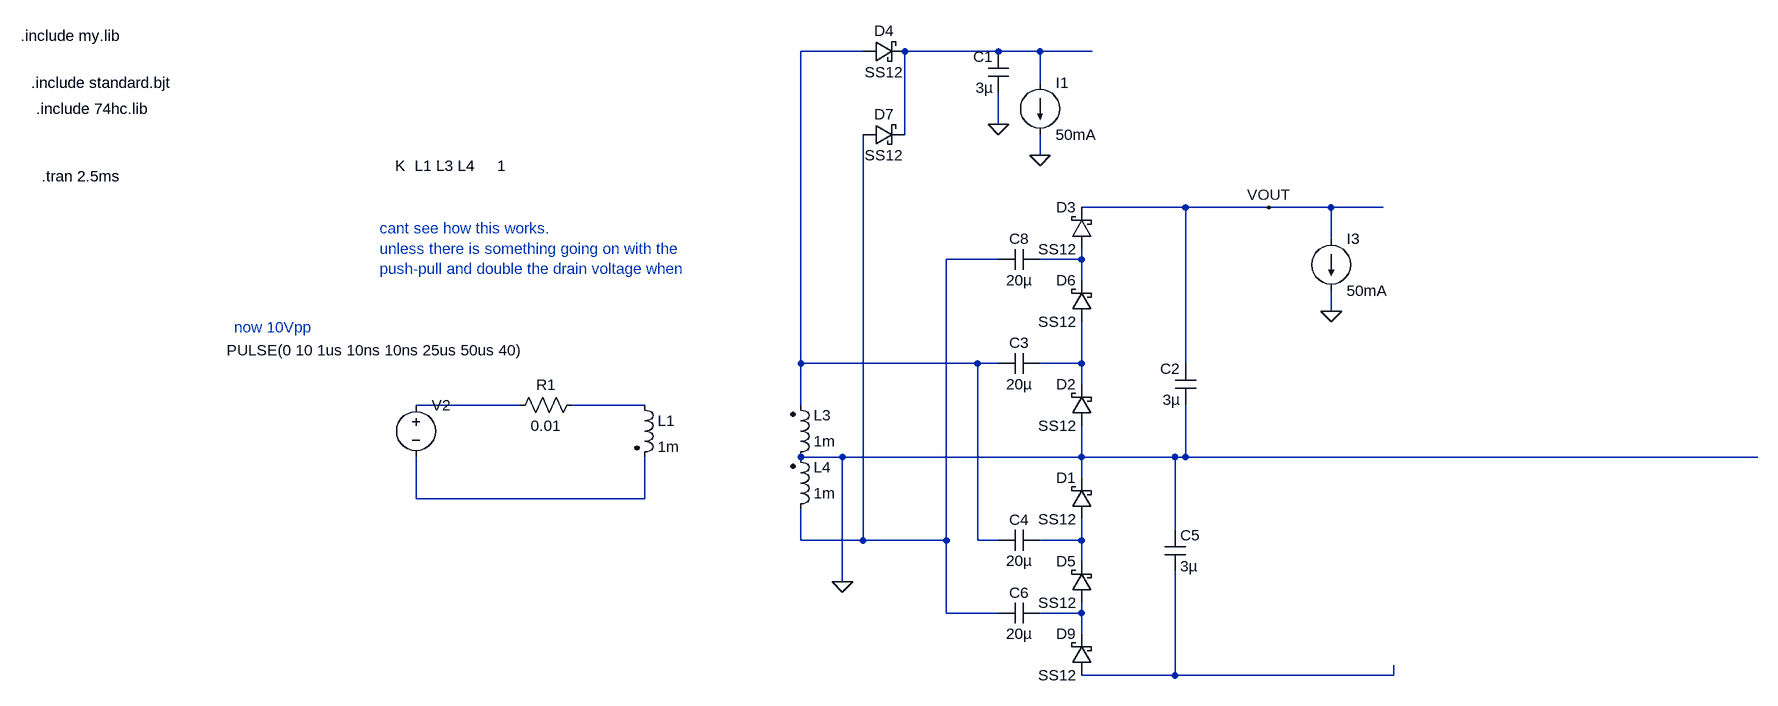
[diagram p0: schematic Draft100.asc]
Draft100.asc, the LTspice schematic file:
Version 4
SHEET 1 5720 1740
WIRE 1840 -672 1744 -672
WIRE 2048 -672 1904 -672
WIRE 2112 -672 2048 -672
WIRE 2192 -672 2112 -672
WIRE 2112 -624 2112 -672
WIRE 2048 -560 2048 -608
WIRE 1904 -544 1904 -672
WIRE 2112 -512 2112 -544
WIRE 2336 -432 2176 -432
WIRE 2464 -432 2336 -432
WIRE 2560 -432 2464 -432
WIRE 2640 -432 2560 -432
WIRE 2560 -384 2560 -432
WIRE 2048 -352 1968 -352
WIRE 2176 -352 2176 -368
WIRE 2176 -352 2112 -352
WIRE 2176 -320 2176 -352
WIRE 2560 -272 2560 -304
WIRE 1744 -192 1744 -672
WIRE 2016 -192 1744 -192
WIRE 2048 -192 2016 -192
WIRE 2176 -192 2176 -256
WIRE 2176 -192 2112 -192
WIRE 2336 -192 2336 -432
WIRE 2176 -160 2176 -192
WIRE 1312 -128 1152 -128
WIRE 1504 -128 1392 -128
WIRE 1744 -128 1744 -192
WIRE 1808 -48 1744 -48
WIRE 2176 -48 2176 -96
WIRE 2176 -48 1808 -48
WIRE 2320 -48 2176 -48
WIRE 2336 -48 2336 -128
WIRE 2336 -48 2320 -48
WIRE 3216 -48 2336 -48
WIRE 2176 -16 2176 -48
WIRE 1152 16 1152 -48
WIRE 1504 16 1504 -48
WIRE 1504 16 1152 16
WIRE 2320 64 2320 -48
WIRE 1744 80 1744 32
WIRE 1840 80 1840 -544
WIRE 1840 80 1744 80
WIRE 1968 80 1968 -352
WIRE 1968 80 1840 80
WIRE 2016 80 2016 -192
WIRE 2048 80 2016 80
WIRE 2176 80 2176 48
WIRE 2176 80 2112 80
WIRE 2176 112 2176 80
WIRE 1808 144 1808 -48
WIRE 1968 192 1968 80
WIRE 2048 192 1968 192
WIRE 2176 192 2176 176
WIRE 2176 192 2112 192
WIRE 2176 224 2176 192
WIRE 2320 288 2320 128
WIRE 2320 288 2176 288
WIRE 2656 288 2656 272
WIRE 2656 288 2320 288
FLAG 1808 144 0
FLAG 2464 -432 VOUT
FLAG 2560 -272 0
FLAG 2048 -560 0
FLAG 2112 -512 0
SYMBOL ind2 1728 -32 M180
WINDOW 0 36 80 Left 2
WINDOW 3 36 40 Left 2
SYMATTR InstName L3
SYMATTR Value 1m
SYMATTR Type ind
SYMBOL ind2 1728 48 M180
WINDOW 0 36 80 Left 2
WINDOW 3 36 40 Left 2
SYMATTR InstName L4
SYMATTR Value 1m
SYMATTR Type ind
SYMBOL ind2 1488 -144 R0
SYMATTR InstName L1
SYMATTR Value 1m
SYMATTR Type ind
SYMBOL voltage 1152 -144 R0
WINDOW 123 0 0 Left 0
WINDOW 39 0 0 Left 0
WINDOW 3 -291 -68 Left 2
SYMATTR Value PULSE(0 10 1us 10ns 10ns 25us 50us 40)
SYMATTR InstName V2
SYMBOL cap 2112 -208 R90
WINDOW 0 0 32 VBottom 2
WINDOW 3 32 32 VTop 2
SYMATTR InstName C3
SYMATTR Value 20µ
SYMBOL cap 2112 64 R90
WINDOW 0 0 32 VBottom 2
WINDOW 3 32 32 VTop 2
SYMATTR InstName C4
SYMATTR Value 20µ
SYMBOL cap 2304 64 R0
SYMATTR InstName C5
SYMATTR Value 3µ
SYMBOL current 2560 -384 R0
WINDOW 123 0 0 Left 0
WINDOW 39 0 0 Left 0
SYMATTR InstName I3
SYMATTR Value 50mA
SYMBOL schottky 2192 -96 R180
WINDOW 0 24 64 Left 2
WINDOW 3 24 0 Left 2
SYMATTR InstName D2
SYMATTR Value SS12
SYMATTR Description Diode
SYMATTR Type diode
SYMBOL schottky 2192 176 R180
WINDOW 0 24 64 Left 2
WINDOW 3 24 0 Left 2
SYMATTR InstName D5
SYMATTR Value SS12
SYMATTR Description Diode
SYMATTR Type diode
SYMBOL schottky 2192 48 R180
WINDOW 0 24 64 Left 2
WINDOW 3 24 0 Left 2
SYMATTR InstName D1
SYMATTR Value SS12
SYMATTR Description Diode
SYMATTR Type diode
SYMBOL schottky 2192 -256 R180
WINDOW 0 24 64 Left 2
WINDOW 3 24 0 Left 2
SYMATTR InstName D6
SYMATTR Value SS12
SYMATTR Description Diode
SYMATTR Type diode
SYMBOL cap 2352 -128 R180
WINDOW 0 24 56 Left 2
WINDOW 3 24 8 Left 2
SYMATTR InstName C2
SYMATTR Value 3µ
SYMBOL schottky 2192 -368 R180
WINDOW 0 24 64 Left 2
WINDOW 3 24 0 Left 2
SYMATTR InstName D3
SYMATTR Value SS12
SYMATTR Description Diode
SYMATTR Type diode
SYMBOL cap 2112 -368 R90
WINDOW 0 0 32 VBottom 2
WINDOW 3 32 32 VTop 2
SYMATTR InstName C8
SYMATTR Value 20µ
SYMBOL schottky 2192 288 R180
WINDOW 0 24 64 Left 2
WINDOW 3 24 0 Left 2
SYMATTR InstName D9
SYMATTR Value SS12
SYMATTR Description Diode
SYMATTR Type diode
SYMBOL res 1408 -144 R90
WINDOW 0 0 56 VBottom 2
WINDOW 3 32 56 VTop 2
SYMATTR InstName R1
SYMATTR Value 0.01
SYMBOL schottky 1840 -656 R270
WINDOW 0 32 32 VTop 2
WINDOW 3 0 32 VBottom 2
SYMATTR InstName D4
SYMATTR Value SS12
SYMATTR Description Diode
SYMATTR Type diode
SYMBOL schottky 1840 -528 R270
WINDOW 0 32 32 VTop 2
WINDOW 3 0 32 VBottom 2
SYMATTR InstName D7
SYMATTR Value SS12
SYMATTR Description Diode
SYMATTR Type diode
SYMBOL cap 2064 -608 R180
WINDOW 0 24 56 Left 2
WINDOW 3 24 8 Left 2
SYMATTR InstName C1
SYMATTR Value 3µ
SYMBOL current 2112 -624 R0
WINDOW 123 0 0 Left 0
WINDOW 39 0 0 Left 0
SYMATTR InstName I1
SYMATTR Value 50mA
SYMBOL cap 2112 176 R90
WINDOW 0 0 32 VBottom 2
WINDOW 3 32 32 VTop 2
SYMATTR InstName C6
SYMATTR Value 20µ
TEXT 576 -480 Left 2 !.tran 2.5ms
TEXT 1120 -496 Left 2 !K  L1 L3 L4     1
TEXT 560 -624 Left 2 !.include standard.bjt
TEXT 544 -696 Left 2 !.include my.lib
TEXT 568 -584 Left 2 !.include 74hc.lib
TEXT 872 -248 Left 2 ;now 10Vpp
TEXT 1096 -400 Left 2 ;cant see how this works.\nunless there is something going on with the \npush-pull and double the drain voltage when

The netlist it stands for:
* Draft100.asc
L3 0 N001 1m
L4 N003 0 1m
L1 N007 N008 1m
V2 N006 N008 PULSE(0 10 1us 10ns 10ns 25us 50us 40)
C3 N005 N001 20µ
C4 N009 N001 20µ
C5 0 N011 3µ
I3 VOUT 0 50mA
D2 0 N005 SS12
D5 N010 N009 SS12
D1 N009 0 SS12
D6 N005 N004 SS12
C2 0 VOUT 3µ
D3 N004 VOUT SS12
C8 N004 N003 20µ
D9 N011 N010 SS12
R1 N007 N006 0.01
D4 N001 N002 SS12
D7 N003 N002 SS12
C1 0 N002 3µ
I1 N002 0 50mA
C6 N010 N003 20µ
.model D D
.lib standard.dio
.tran 2.5ms
K  L1 L3 L4     1
.include standard.bjt
.include my.lib
.include 74hc.lib
* now 10Vpp
* cant see how this works.
* unless there is something going on with the
* push-pull and double the drain voltage when
.backanno
.end